# Altium schematic sheet Triangular_Wave.SchDoc
size A; SheetNumber: 4; SheetTotal: 6
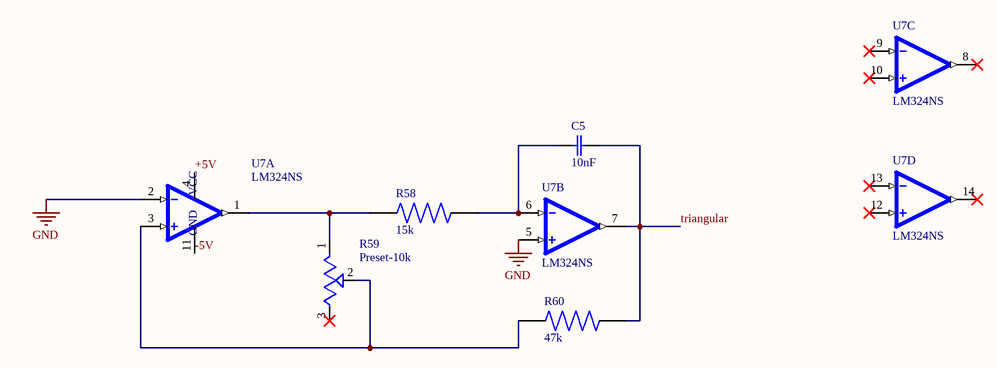
[diagram p0: Triangular_Wave.SchDoc]

## Parts
C5  10nF  [CAPC2013X110N]
R58  15k  [RES_ERA6ARB153V]
R59  Preset-10k  [TRIM_3306F-1-103]
R60  47k  [RESC2012X60N]
U7  LM324NS  [SOIC127P780X200-14N]  (parts A,B,C,D of 4)

## Nets
GND: U7.2(1IN-) U7.5(2IN+)
+5V: U7.4(VCC)
-5V: U7.11(GND)
triangular: C5.2(C2) R60.2 U7.7(2OUT)
NetC5_1: C5.1(C1) R58.2 U7.6(2IN-)
NetR58_1: R58.1 R59.1(CCW) U7.1(1OUT)
NetR59_2: R59.2(W) R60.1 U7.3(1IN+)

Not connected (* = marked no-connect by the designer): R59 3(CW)*; U7 8(3OUT)* 9(3IN-)* 10(3IN+)* 12(4IN+)* 13(4IN-)* 14(4OUT)*

## Library data of the parts
C5 = 10nF: 10000 pF Â±10% 50V Ceramic Capacitor X7R 0805 (2012 Metric); CC0805KRX7R9BB103; MF: Yageo; SnapEDA_Link: https://www.snapeda.com/parts/CC0805KRX7R9BB103/Yageo/view-part/?ref=snap; Package: 0805 Yageo; Value: *; MP: CC0805KRX7R9BB103; Check_prices: https://www.snapeda.com/parts/CC0805KRX7R9BB103/Yageo/view-part/?ref=eda
R58 = 15k: ERA6ARB153V; Availability: Unavailable; Price: None; Package: None; Value: *; MP: ERA6ARB153V
R59 = Preset: TRIMMER - 6MM ROUND, SINGLE-TURN,CERMET, 10K OHMS | Bourns 3306F-1-103; SnapEDA_Link: https://www.snapeda.com/parts/3306F-1-103/Bourns/view-part/?ref=snap; Package: 3306F Bourns; Value: *; MF: Bourns; MP: 3306F-1-103; Check_prices: https://www.snapeda.com/parts/3306F-1-103/Bourns/view-part/?ref=eda
R60 = 47k: 47 kOhms Â±1% 0.125W, 1/8W Chip Resistor 0805 (2012 Metric) Moisture Resistant Thick Film; RC0805FR-0747KL; MF: Yageo; SnapEDA_Link: https://www.snapeda.com/parts/RC0805FR-0747KL/Yageo/view-part/?ref=snap; Package: 2012 Yageo; Value: *; MP: RC0805FR-0747KL; Check_prices: https://www.snapeda.com/parts/RC0805FR-0747KL/Yageo/view-part/?ref=eda
U7 = LM324NS: 4-Channel industry standard operational amplifier 14-SO 0 to 70; LM324NSRG4; MF: Texas Instruments; Purchase-URL: https://pricing.snapeda.com/search/part/LM324NSRG4/?ref=eda; MP: LM324NSRG4; SnapEDA_Link: https://www.snapeda.com/parts/LM324NSRG4/Texas+Instruments/view-part/?ref=snap; Value: *; Package: SOP-14 Texas Instruments; Price: None; Availability: In Stock; Check_prices: https://www.snapeda.com/parts/LM324NSRG4/Texas+Instruments/view-part/?ref=eda